# Altium project AirPi2_Power.PrjPcb
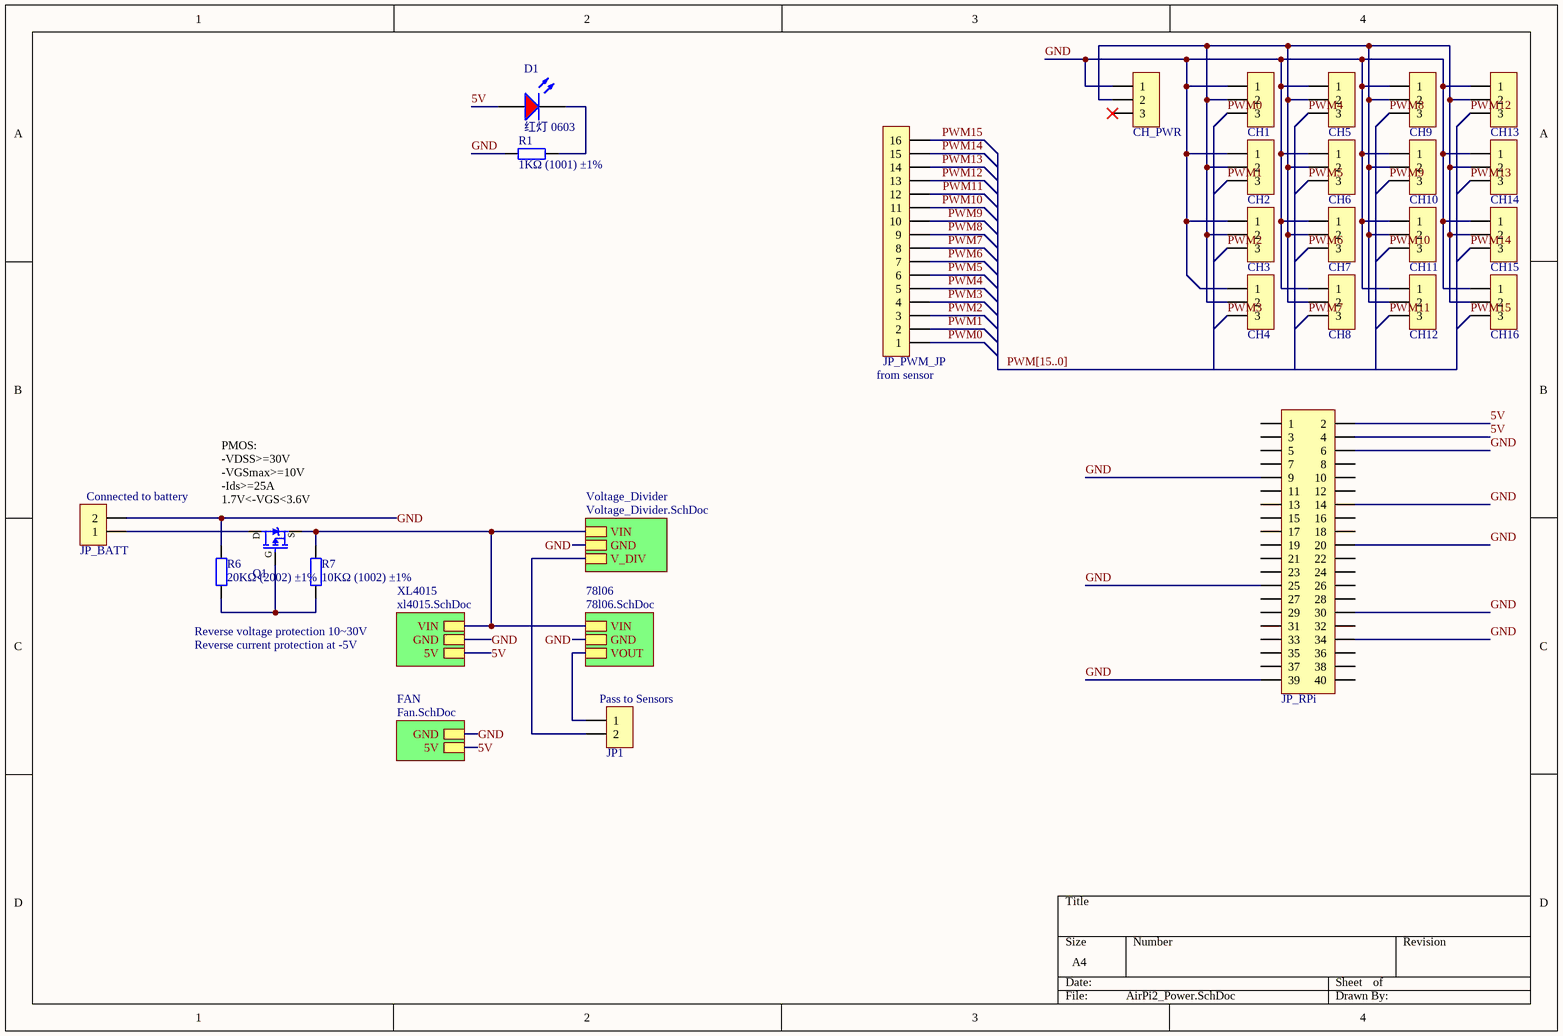
[diagram p0: AirPi2_Power.SchDoc]
4 sheets, 42 parts. Net scope: hierarchical (ports join the sheet entries above them; power ports are global).
Board file: AirPi2_Power.PcbDoc
Sheets:
  AirPi2_Power.SchDoc
    XL4015 = xl4015.SchDoc
    Voltage_Divider = Voltage_Divider.SchDoc
    78l06 = 78l06.SchDoc

## Sheet AirPi2_Power.SchDoc
size A4

### Parts
CH1  HDR-1X3  [HDR2.54-LI-3P]  (value not drawn)
CH2  HDR-1X3  [HDR2.54-LI-3P]  (value not drawn)
CH3  HDR-1X3  [HDR2.54-LI-3P]  (value not drawn)
CH4  HDR-1X3  [HDR2.54-LI-3P]  (value not drawn)
CH5  HDR-1X3  [HDR2.54-LI-3P]  (value not drawn)
CH6  HDR-1X3  [HDR2.54-LI-3P]  (value not drawn)
CH7  HDR-1X3  [HDR2.54-LI-3P]  (value not drawn)
CH8  HDR-1X3  [HDR2.54-LI-3P]  (value not drawn)
CH9  HDR-1X3  [HDR2.54-LI-3P]  (value not drawn)
CH10  HDR-1X3  [HDR2.54-LI-3P]  (value not drawn)
CH11  HDR-1X3  [HDR2.54-LI-3P]  (value not drawn)
CH12  HDR-1X3  [HDR2.54-LI-3P]  (value not drawn)
CH13  HDR-1X3  [HDR2.54-LI-3P]  (value not drawn)
CH14  HDR-1X3  [HDR2.54-LI-3P]  (value not drawn)
CH15  HDR-1X3  [HDR2.54-LI-3P]  (value not drawn)
CH16  HDR-1X3  [HDR2.54-LI-3P]  (value not drawn)
CH_PWR  HDR-1X3  [HDR2.54-LI-3P]  (value not drawn)
D1  红灯 0603  [0603_LED_S1]
JP1  HDR-1X2  [HDR2.54-M-LI-2P]  (value not drawn)
JP_BATT  HDR-1X2  [XH2.54-WI-2P]  (value not drawn)
JP_PWM_JP  HDR-1X16  [HDR2.54-M-LI-16P]  (value not drawn)
JP_RPi  Header 2X11  [HDR2.54-LI-2x20P]  (value not drawn)
Q1  D15P05  [TO252]  (value not drawn)
R1  1KΩ (1001) ±1%  [0805_R]
R6  20KΩ (2002) ±1%  [0805_R]
R7  10KΩ (1002) ±1%  [0805_R]

### Sub-sheets
78l06 = 78l06.SchDoc: GND, VIN, VOUT
FAN = Fan.SchDoc (file not in this document): GND, 5V
Voltage_Divider = Voltage_Divider.SchDoc: VIN, GND, V_DIV
XL4015 = xl4015.SchDoc: VIN, GND, 5V

### Nets
5V: D1.A JP_RPi.2 JP_RPi.4 ; sheet XL4015/5V, sheet FAN/5V
GND: CH1.1 CH2.1 CH3.1 CH4.1 CH5.1 CH6.1 CH7.1 CH8.1 CH9.1 CH10.1 CH11.1 CH12.1 CH13.1 CH14.1 CH15.1 CH16.1 CH_PWR.1 JP_BATT.2 JP_RPi.6 JP_RPi.9 JP_RPi.14 JP_RPi.20 JP_RPi.25 JP_RPi.30 JP_RPi.34 JP_RPi.39 R1.1 R6.2 ; sheet XL4015/GND, sheet FAN/GND, sheet Voltage_Divider/GND, sheet 78l06/GND
PWM0: CH1.3 JP_PWM_JP.1
PWM1: CH2.3 JP_PWM_JP.2
PWM2: CH3.3 JP_PWM_JP.3
PWM3: CH4.3 JP_PWM_JP.4
PWM4: CH5.3 JP_PWM_JP.5
PWM5: CH6.3 JP_PWM_JP.6
PWM6: CH7.3 JP_PWM_JP.7
PWM7: CH8.3 JP_PWM_JP.8
PWM8: CH9.3 JP_PWM_JP.9
PWM9: CH10.3 JP_PWM_JP.10
PWM10: CH11.3 JP_PWM_JP.11
PWM11: CH12.3 JP_PWM_JP.12
PWM12: CH13.3 JP_PWM_JP.13
PWM13: CH14.3 JP_PWM_JP.14
PWM14: CH15.3 JP_PWM_JP.15
PWM15: CH16.3 JP_PWM_JP.16
NetC1_2: Q1.3(D) R7.2 ; sheet XL4015/VIN, sheet Voltage_Divider/VIN, sheet 78l06/VIN
NetC2_2: JP1.1 ; sheet 78l06/VOUT
NetCH1_2: CH1.2 CH2.2 CH3.2 CH4.2 CH5.2 CH6.2 CH7.2 CH8.2 CH9.2 CH10.2 CH11.2 CH12.2 CH13.2 CH14.2 CH15.2 CH16.2 CH_PWR.2
NetD1_K: D1.K R1.2
NetJP1_2: JP1.2 ; sheet Voltage_Divider/V_DIV
NetJP_BATT_1: JP_BATT.1 Q1.2(S)
NetQ1_1: Q1.1(G) R6.1 R7.1

Not connected (* = marked no-connect by the designer): CH_PWR 3*; JP_RPi 1 3 5 7 8 10 11 12 13 15 16 17 18 19 21 22 23 24 26 27 28 29 31 32 33 35 36 37 38 40

### Buses and harness runs
bus PWM[15..0]

### Notes on the sheet
- (near JP_PWM_JP) from sensor
- (near JP_BATT) Connected to battery
- (near Q1) PMOS:
  -VDSS>=30V
  -VGSmax>=10V
  -Ids>=25A
  1.7V<-VGS<3.6V
- Reverse voltage protection 10~30V
- Reverse current protection at -5V
- (near JP1) Pass to Sensors

### Library data of the parts
CH1-CH16 CH_PWR = Header 3: 3P接插件; 版权归属: 源创客; BOM名称: 3P接插件; 学习资源: www.ooocke.com
D1 = 0603 红灯: 发光二极管; ComponentLink1Description: 供应商链接; ComponentLink1URL: http://www.szlcsc.com/product/details_2659.html; Package: 0603; Supplier: LC; SuppliersPartNumber: C2286
JP1 JP_BATT = Header 2: 2P接插件; 版权归属: 源创客; BOM名称: 2P接插件; 学习资源: www.ooocke.com
JP_PWM_JP = Header 16: 16P接插件; 版权归属: 源创客; BOM名称: 16P接插件; 学习资源: www.ooocke.com
JP_RPi = Header 20X2: 20*2P接插件; 版权归属: 源创客; BOM名称: 20*2P接插件; 学习资源: www.ooocke.com
Q1 = D15P05: P沟道 50V/15A; BOM名称: 场效应管; 版权归属: 源创客; 学习资源: www.ooocke.com; 描述: P沟道 50V/15A
R1 = 0805 1KΩ (1001) 1%: 贴片电阻; ComponentLink1Description: 供应商链接; ComponentLink1URL: http://www.szlcsc.com/product/details_18201.html; Package: 0805; Supplier: LC; SuppliersPartNumber: C17513
R6 = 0805 20KΩ (2002) 1%: 贴片电阻; ComponentLink1Description: 供应商链接; ComponentLink1URL: http://www.szlcsc.com/product/details_4735.html; Package: 0805; Supplier: LC; SuppliersPartNumber: C4328
R7 = 0805 10KΩ (1002) 1%: 贴片电阻; ComponentLink1Description: 供应商链接; ComponentLink1URL: http://www.szlcsc.com/product/details_18102.html; Package: 0805; Supplier: LC; SuppliersPartNumber: C17414

## Sheet xl4015.SchDoc
size A4
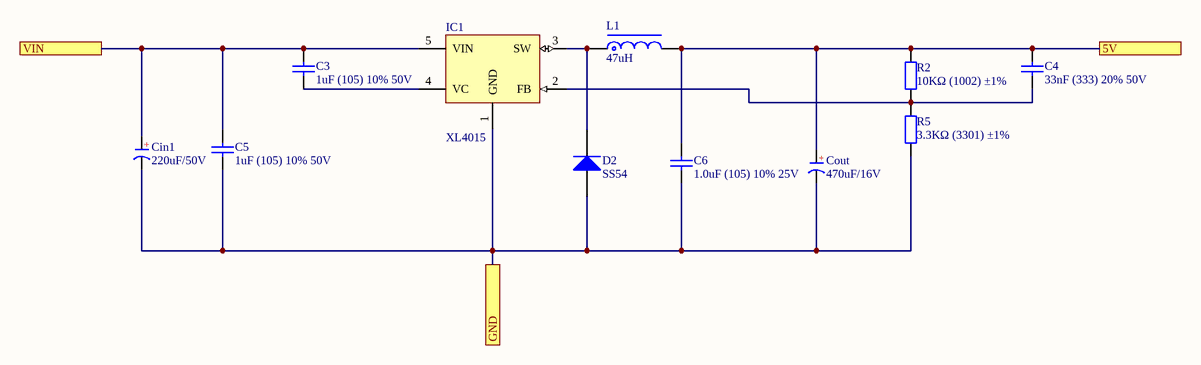
[diagram p1: xl4015.SchDoc]

### Parts
C3  1uF (105) 10% 50V  [0603_C]
C4  33nF (333) 20% 50V  [0402_C]
C5  1uF (105) 10% 50V  [0603_C]
C6  1.0uF (105) 10% 25V  [0402_C]
Cin1  220uF/50V  [CM F(10*10.2)]
Cout  470uF/16V  [CM E(8*10.2)]
D2  SS54  [SMA(DO-214AC)_S1]
IC1  XL4015  [TO263-5A]
L1  47uH  [CDRH127]
R2  10KΩ (1002) ±1%  [0603_R]
R5  3.3KΩ (3301) ±1%  [0603_R]

### Ports
5V, GND, VIN

### Nets
5V: C4.2 C6.2 Cout.1(A) L1.2 R2.2 ; port 5V
GND: C5.1 C6.1 Cin1.2(K) Cout.2(K) D2.1(A) IC1.1(GND) R5.1 ; port GND
NetC1_2: C3.2 C5.2 Cin1.1(A) IC1.5(VIN) ; port VIN
NetC3_1: C3.1 IC1.4(VC)
NetC4_1: C4.1 IC1.2(FB) R2.1 R5.2
NetD2_2: D2.2(K) IC1.3(SW) L1.1

### Notes on the sheet
- (in symbol C-CM) +

### Library data of the parts
C3 C5 = 0603 1uF (105) 10% 50V: 贴片电容; ComponentLink1Description: 供应商链接; ComponentLink1URL: http://www.szlcsc.com/product/details_16531.html; Package: 0603; Supplier: LC; SuppliersPartNumber: C15849
C4 = 0402 33nF (333) 20% 50V: 贴片电容; ComponentLink1Description: 供应商链接; ComponentLink1URL: http://www.szlcsc.com/product/details_1937.html; Package: 0402; Supplier: LC; SuppliersPartNumber: C1585
C6 = 0402 1.0uF (105) 10% 25V: 贴片电容; ComponentLink1Description: 供应商链接; ComponentLink1URL: http://www.szlcsc.com/product/details_53938.html; Package: 0402; Supplier: LC; SuppliersPartNumber: C52923
Cin1 Cout = C-CM: 贴片电解电容; 版权归属: 源创客; BOM名称: 贴片电解电容; 学习资源: www.ooocke.com
D2 = SMA(DO-214AC) SS54: 二极管; ComponentLink1Description: 供应商链接; ComponentLink1URL: http://www.szlcsc.com/product/details_23178.html; Package: SMA(DO-214AC); Supplier: LC; SuppliersPartNumber: C22452
IC1 = XL4015: DC降压芯片; 版权归属: 源创客; BOM名称: DC降压芯片; 学习资源: www.ooocke.com
L1 = L-CDRH: 功率屏蔽电感; 版权归属: 源创客; BOM名称: 功率屏蔽电感; 学习资源: www.ooocke.com
R2 = 0603 10KΩ (1002) 1%: 贴片电阻; ComponentLink1Description: 供应商链接; ComponentLink1URL: http://www.szlcsc.com/product/details_26547.html; Package: 0603; Supplier: LC; SuppliersPartNumber: C25804
R5 = 0603 3.3KΩ (3301) 1%: 贴片电阻; ComponentLink1Description: 供应商链接; ComponentLink1URL: http://www.szlcsc.com/product/details_23705.html; Package: 0603; Supplier: LC; SuppliersPartNumber: C22978

## Sheet Voltage_Divider.SchDoc
size A4
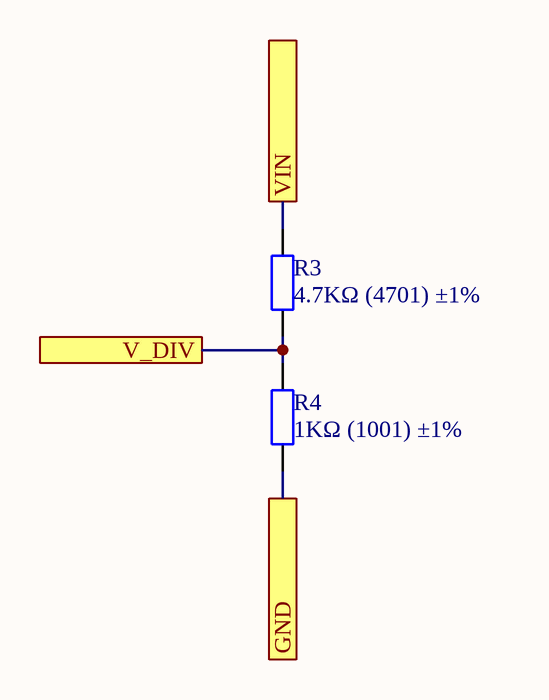
[diagram p2: Voltage_Divider.SchDoc]

### Parts
R3  4.7KΩ (4701) ±1%  [0805_R]
R4  1KΩ (1001) ±1%  [0805_R]

### Ports
GND, V_DIV, VIN

### Nets
GND: R4.1 ; port GND
NetC1_2: R3.2 ; port VIN
NetJP1_2: R3.1 R4.2 ; port V_DIV

### Library data of the parts
R3 = 0805 4.7KΩ (4701) 1%: 贴片电阻; ComponentLink1Description: 供应商链接; ComponentLink1URL: http://www.szlcsc.com/product/details_18361.html; Package: 0805; Supplier: LC; SuppliersPartNumber: C17673
R4 = 0805 1KΩ (1001) 1%: 贴片电阻; ComponentLink1Description: 供应商链接; ComponentLink1URL: http://www.szlcsc.com/product/details_18201.html; Package: 0805; Supplier: LC; SuppliersPartNumber: C17513

## Sheet 78l06.SchDoc
size A4
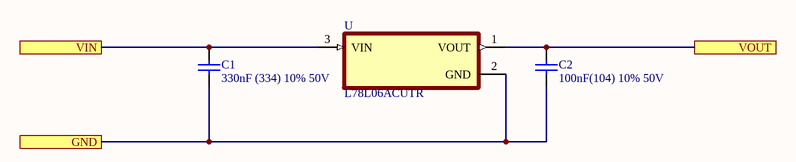
[diagram p3: 78l06.SchDoc]

### Parts
C1  330nF (334) 10% 50V  [0805_C]
C2  100nF(104) 10% 50V  [0805_C]
U  L78L06ACUTR  [VREG_L78L12ABUTR]

### Ports
GND, VIN, VOUT

### Nets
GND: C1.1 C2.1 U.2(GND) ; port GND
NetC1_2: C1.2 U.3(VIN) ; port VIN
NetC2_2: C2.2 U.1(VOUT) ; port VOUT

### Library data of the parts
C1 = 0805 330nF (334) 10% 50V: 贴片电容; ComponentLink1Description: 供应商链接; ComponentLink1URL: http://www.szlcsc.com/product/details_2092.html; Package: 0805; Supplier: LC; SuppliersPartNumber: C1740
C2 = 0805 100nF(104) 10% 50V: 贴片电容; ComponentLink1Description: 供应商链接; ComponentLink1URL: http://www.szlcsc.com/product/details_50686.html; Package: 0805; Supplier: LC; SuppliersPartNumber: C49678
U = L78L06ACUTR: Linear Voltage Regulator IC 1 Output 100mA SOT-89-3; MF: STMicroelectronics; Package: SOT-89-3 STMicroelectronics; MP: L78L06ACUTR; Value: *; SnapEDA_Link: https://www.snapeda.com/parts/L78L06ACUTR/STMicroelectronics/view-part/1221968/?ref=snap; Availability: Unavailable; Price: None; DigiKey-Purchase-URL: https://snapeda.com/shop?store=DigiKey&id=1221968

## Nets that join several sheets
5V: AirPi2_Power (D1.A JP_RPi.2 JP_RPi.4), xl4015 (5 pins)
GND: AirPi2_Power (28 pins), xl4015 (7 pins), Voltage_Divider (R4.1), 78l06 (C1.1 C2.1 U.2)
NetC1_2: AirPi2_Power (Q1.3 R7.2), xl4015 (C3.2 C5.2 Cin1.1 IC1.5), Voltage_Divider (R3.2), 78l06 (C1.2 U.3)
NetC2_2: AirPi2_Power (JP1.1), 78l06 (C2.2 U.1)
NetJP1_2: AirPi2_Power (JP1.2), Voltage_Divider (R3.1 R4.2)